# Altium project Anemoia-ESP32.PrjPcb
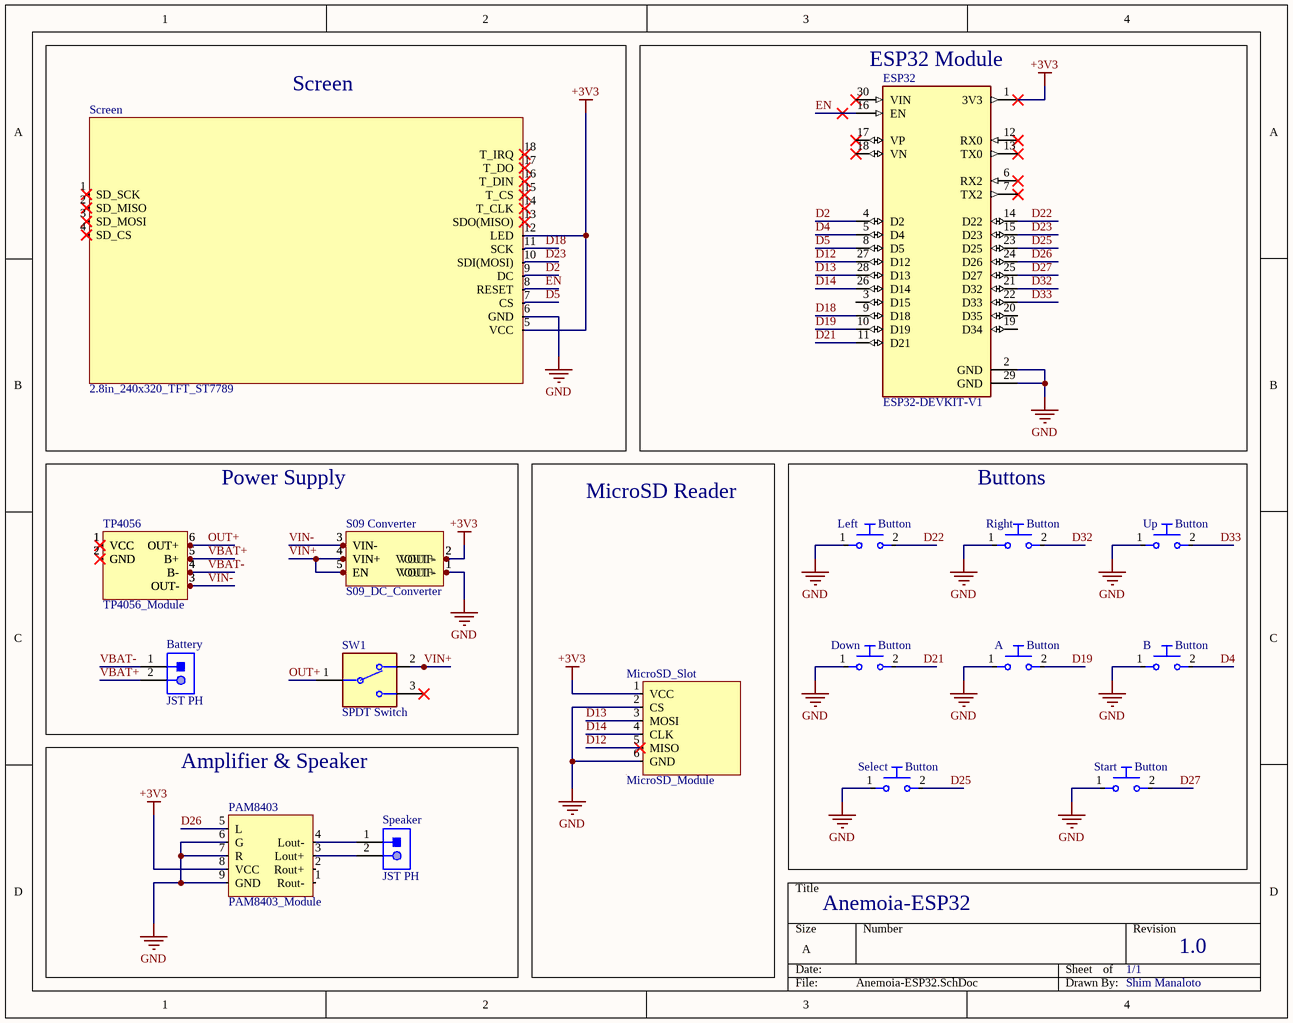
[diagram p0: Anemoia-ESP32.SchDoc]
1 sheet, 17 parts. Net scope: global (net labels, ports and power ports of the same name join across sheets).
Board file: Anemoia-ESP32.PcbDoc

## Sheet Anemoia-ESP32.SchDoc
size A; SheetNumber: 1; SheetTotal: 1

### Parts
A  Button  [12x12x7.3mm_Tactile_Push_Button]
B  Button  [12x12x7.3mm_Tactile_Push_Button]
Battery  JST PH  [JST-S2B-PH-K-S_V]
Down  Button  [12x12x7.3mm_Tactile_Push_Button]
ESP32  ESP32-DEVKIT-V1  [MODULE_ESP32_DEVKIT_V1]
Left  Button  [12x12x7.3mm_Tactile_Push_Button]
MicroSD_Slot  MicroSD_Module  [MicroSD_Module]
PAM8403  PAM8403_Module  [PAM8403]
Right  Button  [12x12x7.3mm_Tactile_Push_Button]
S09_Converter  S09_DC_Converter  [S09_DC_Converter]
Screen  2.8in_240x320_TFT_ST7789  [2.8in_240x320_TFT_ST7789]
Select  Button  [12x12x7.3mm_Tactile_Push_Button]
Speaker  JST PH  [JST-S2B-PH-K-S_V]
Start  Button  [12x12x7.3mm_Tactile_Push_Button]
SW1  SPDT Switch  [SPDT_Switch]
TP4056  TP4056_Module  [TP4056_Module]
Up  Button  [12x12x7.3mm_Tactile_Push_Button]

### Blocks framed on the sheet
Screen: Screen
ESP32 Module: ESP32
Power Supply: Battery S09_Converter SW1 TP4056
MicroSD Reader: MicroSD_Slot
Buttons: A B Down Left Right Select Start Up
Amplifier & Speaker: PAM8403 Speaker

### Nets
+3V3: ESP32.1(3V3) MicroSD_Slot.1(VCC) PAM8403.8(VCC) S09_Converter.2(VOUT-) Screen.5(VCC) Screen.12(LED)
GND: A.1 B.1 Down.1 ESP32.2(GND) ESP32.29(GND) Left.1 MicroSD_Slot.2(CS) MicroSD_Slot.6(GND) PAM8403.6(G) PAM8403.7(R) PAM8403.9(GND) Right.1 S09_Converter.1(VOUT+) Screen.6(GND) Select.1 Start.1 Up.1
D2: ESP32.4(D2) Screen.9(DC)
D4: B.2 ESP32.5(D4)
D5: ESP32.8(D5) Screen.7(CS)
D12: ESP32.27(D12) MicroSD_Slot.5(MISO)
D13: ESP32.28(D13) MicroSD_Slot.3(MOSI)
D14: ESP32.26(D14) MicroSD_Slot.4(CLK)
D18: ESP32.9(D18) Screen.11(SCK)
D19: A.2 ESP32.10(D19)
D21: Down.2 ESP32.11(D21)
D22: ESP32.14(D22) Left.2
D23: ESP32.15(D23) Screen.10(SDI(MOSI))
D25: ESP32.23(D25) Select.2
D26: ESP32.24(D26) PAM8403.5(L)
D27: ESP32.25(D27) Start.2
D32: ESP32.21(D32) Right.2
D33: ESP32.22(D33) Up.2
EN: ESP32.16(EN) Screen.8(RESET)
OUT+: SW1.1 TP4056.6(OUT+)
VBAT+: Battery.2 TP4056.5(B+)
VBAT-: Battery.1 TP4056.4(B-)
VIN+: S09_Converter.4(VIN+) S09_Converter.5(EN) SW1.2
VIN-: S09_Converter.3(VIN-) TP4056.3(OUT-)
NetPAM8403_3: PAM8403.3(Lout+) Speaker.2
NetPAM8403_4: PAM8403.4(Lout-) Speaker.1

Not connected (* = marked no-connect by the designer): ESP32 3(D15) 6(RX2)* 7(TX2)* 12(RX0)* 13(TX0)* 17(VP)* 18(VN)* 19(D34) 20(D35) 30(VIN)*; PAM8403 1(Rout-) 2(Rout+); Screen 1(SD_SCK)* 2(SD_MISO)* 3(SD_MOSI)* 4(SD_CS)* 13(SDO(MISO))* 14(T_CLK)* 15(T_CS)* 16(T_DIN)* 17(T_DO)* 18(T_IRQ)*; SW1 3*; TP4056 1(VCC)* 2(GND)*

### Notes on the sheet
- Anemoia-ESP32
- 1/1
- 1.0
- Shim Manaloto

### Library data of the parts
A B Down Left Right Select Start Up = 12x12x7.3mm_Tactile_Push_Button
Battery Speaker = S2B-PH-K-S(LF)(SN): CONN HEADER TH R/A 2POS 2mm; Capacitance: 10µF; Connector Type: Male Pin; Contact Resistance: 20mΩ; Current Rating: 2A; Gender: Male; Insulation Resistance: 1GΩ; Max Voltage Rating (AC): 100V; Number of Contacts: 2; Tolerance: 20%; Voltage Rating: 50V; Supplier 1: Arrow Electronics; Manufacturer: JST; Manufacturer Part Number: S2B-PH-K-S(LF)(SN); RoHS: Compliant; Category: Headers and Wire Housings; Stock 1: 15836; Case/Package: Radial; China RoHS: Compliant; Color: Natural, White; Contact Gender: Male; Contact Material: Brass; Contact Mating Length: 3.302mm; Contact Plating: Tin; Depth: 7.6mm; Diameter: 5mm; Fastening Type: Detent; Flammability Rating: UL94 V-0; Height: 11mm; Lead Free: Lead Free; Lead Pitch: 2mm; Length: 11mm; Lifecycle Status: Production; Max Current Rating: 2A; Max Operating Temperature: 85°C; Max Voltage Rating (DC): 100V; Min Operating Temperature: -25°C; Mount: Through Hole; Number of Pins: 2; Number of Poles: 2; Number of Positions: 2; Number of Rows: 1; Orientation: Right Angle; Packaging: Bulk; Pitch: 2mm; Radiation Hardening: No; REACH SVHC: Yes; Terminal Pitch: 2mm; Termination: Solder; Voltage Rating (AC): 100V; Voltage Rating (DC): 50V; Weight: 28.349523g; Width: 4.5mm; Working Voltage: 100V; ComponentLink1URL: https://datasheet.octopart.com:443/S2B-PH-K-S%28LF%29%28SN%29-JST-datasheet-180491669.pdf?src-supplier=IHS; ComponentLink1Description: https://datasheet.octopart.com:443/S2B-PH-K-S%28LF%29%28SN%29-JST-datasheet-180491669.pdf?src-supplier=IHS; ComponentLink2URL: https://datasheet.octopart.com:443/S2B-PH-K-S%28LF%29%28SN%29-JST-datasheet-10411123.pdf?src-supplier=Upverter; ComponentLink2Description: https://datasheet.octopart.com:443/S2B-PH-K-S%28LF%29%28SN%29-JST-datasheet-10411123.pdf?src-supplier=Upverter; ComponentLink3URL: https://datasheet.octopart.com:443/S2B-PH-K-S%28LF%29%28SN%29-JST-datasheet-8324864.pdf?src-supplier=Upverter; ComponentLink3Description: https://datasheet.octopart.com:443/S2B-PH-K-S%28LF%29%28SN%29-JST-datasheet-8324864.pdf?src-supplier=Upverter; ComponentLink4URL: https://datasheet.octopart.com:443/S2B-PH-K-S%28LF%29%28SN%29-JST-datasheet-56537.pdf?src-supplier=Upverter; ComponentLink4Description: https://datasheet.octopart.com:443/S2B-PH-K-S%28LF%29%28SN%29-JST-datasheet-56537.pdf?src-supplier=Upverter; ComponentLink5URL: https://datasheet.octopart.com:443/S2B-PH-K-S%28LF%29%28SN%29-JST-datasheet-15068535.pdf?src-supplier=Upverter; ComponentLink5Description: https://datasheet.octopart.com:443/S2B-PH-K-S%28LF%29%28SN%29-JST-datasheet-15068535.pdf?src-supplier=Upverter; ComponentLink6URL: https://datasheet.octopart.com:443/S2B-PH-K-S%28LF%29%28SN%29-JST-datasheet-147762421.pdf?src-supplier=LKR; ComponentLink6Description: https://datasheet.octopart.com:443/S2B-PH-K-S%28LF%29%28SN%29-JST-datasheet-147762421.pdf?src-supplier=LKR; ComponentLink7URL: https://datasheet.octopart.com:443/S2B-PH-K-S%28LF%29%28SN%29-JST-datasheet-12510261.pdf?src-supplier=Future+Electronics; ComponentLink7Description: https://datasheet.octopart.com:443/S2B-PH-K-S%28LF%29%28SN%29-JST-datasheet-12510261.pdf?src-supplier=Future+Electronics
ESP32 = ESP32-DEVKIT-V1: Dual core, Wi-Fi: 2.4 GHz up to 150 Mbits/s,BLE (Bluetooth Low Energy) and legacy Bluetooth, 32 bits, Up to 240 MHz; MF: Do it; SnapEDA_Link: https://www.snapeda.com/parts/ESP32-DEVKIT-V1/Do+it/view-part/?ref=snap; Package: None; Value: *; MP: ESP32-DEVKIT-V1; Check_prices: https://www.snapeda.com/parts/ESP32-DEVKIT-V1/Do+it/view-part/?ref=eda
MicroSD_Slot = MicroSD_Module: 3.3V MicroSD Module